# Altium schematic sheet BD4Gv1.SchDoc
size A3
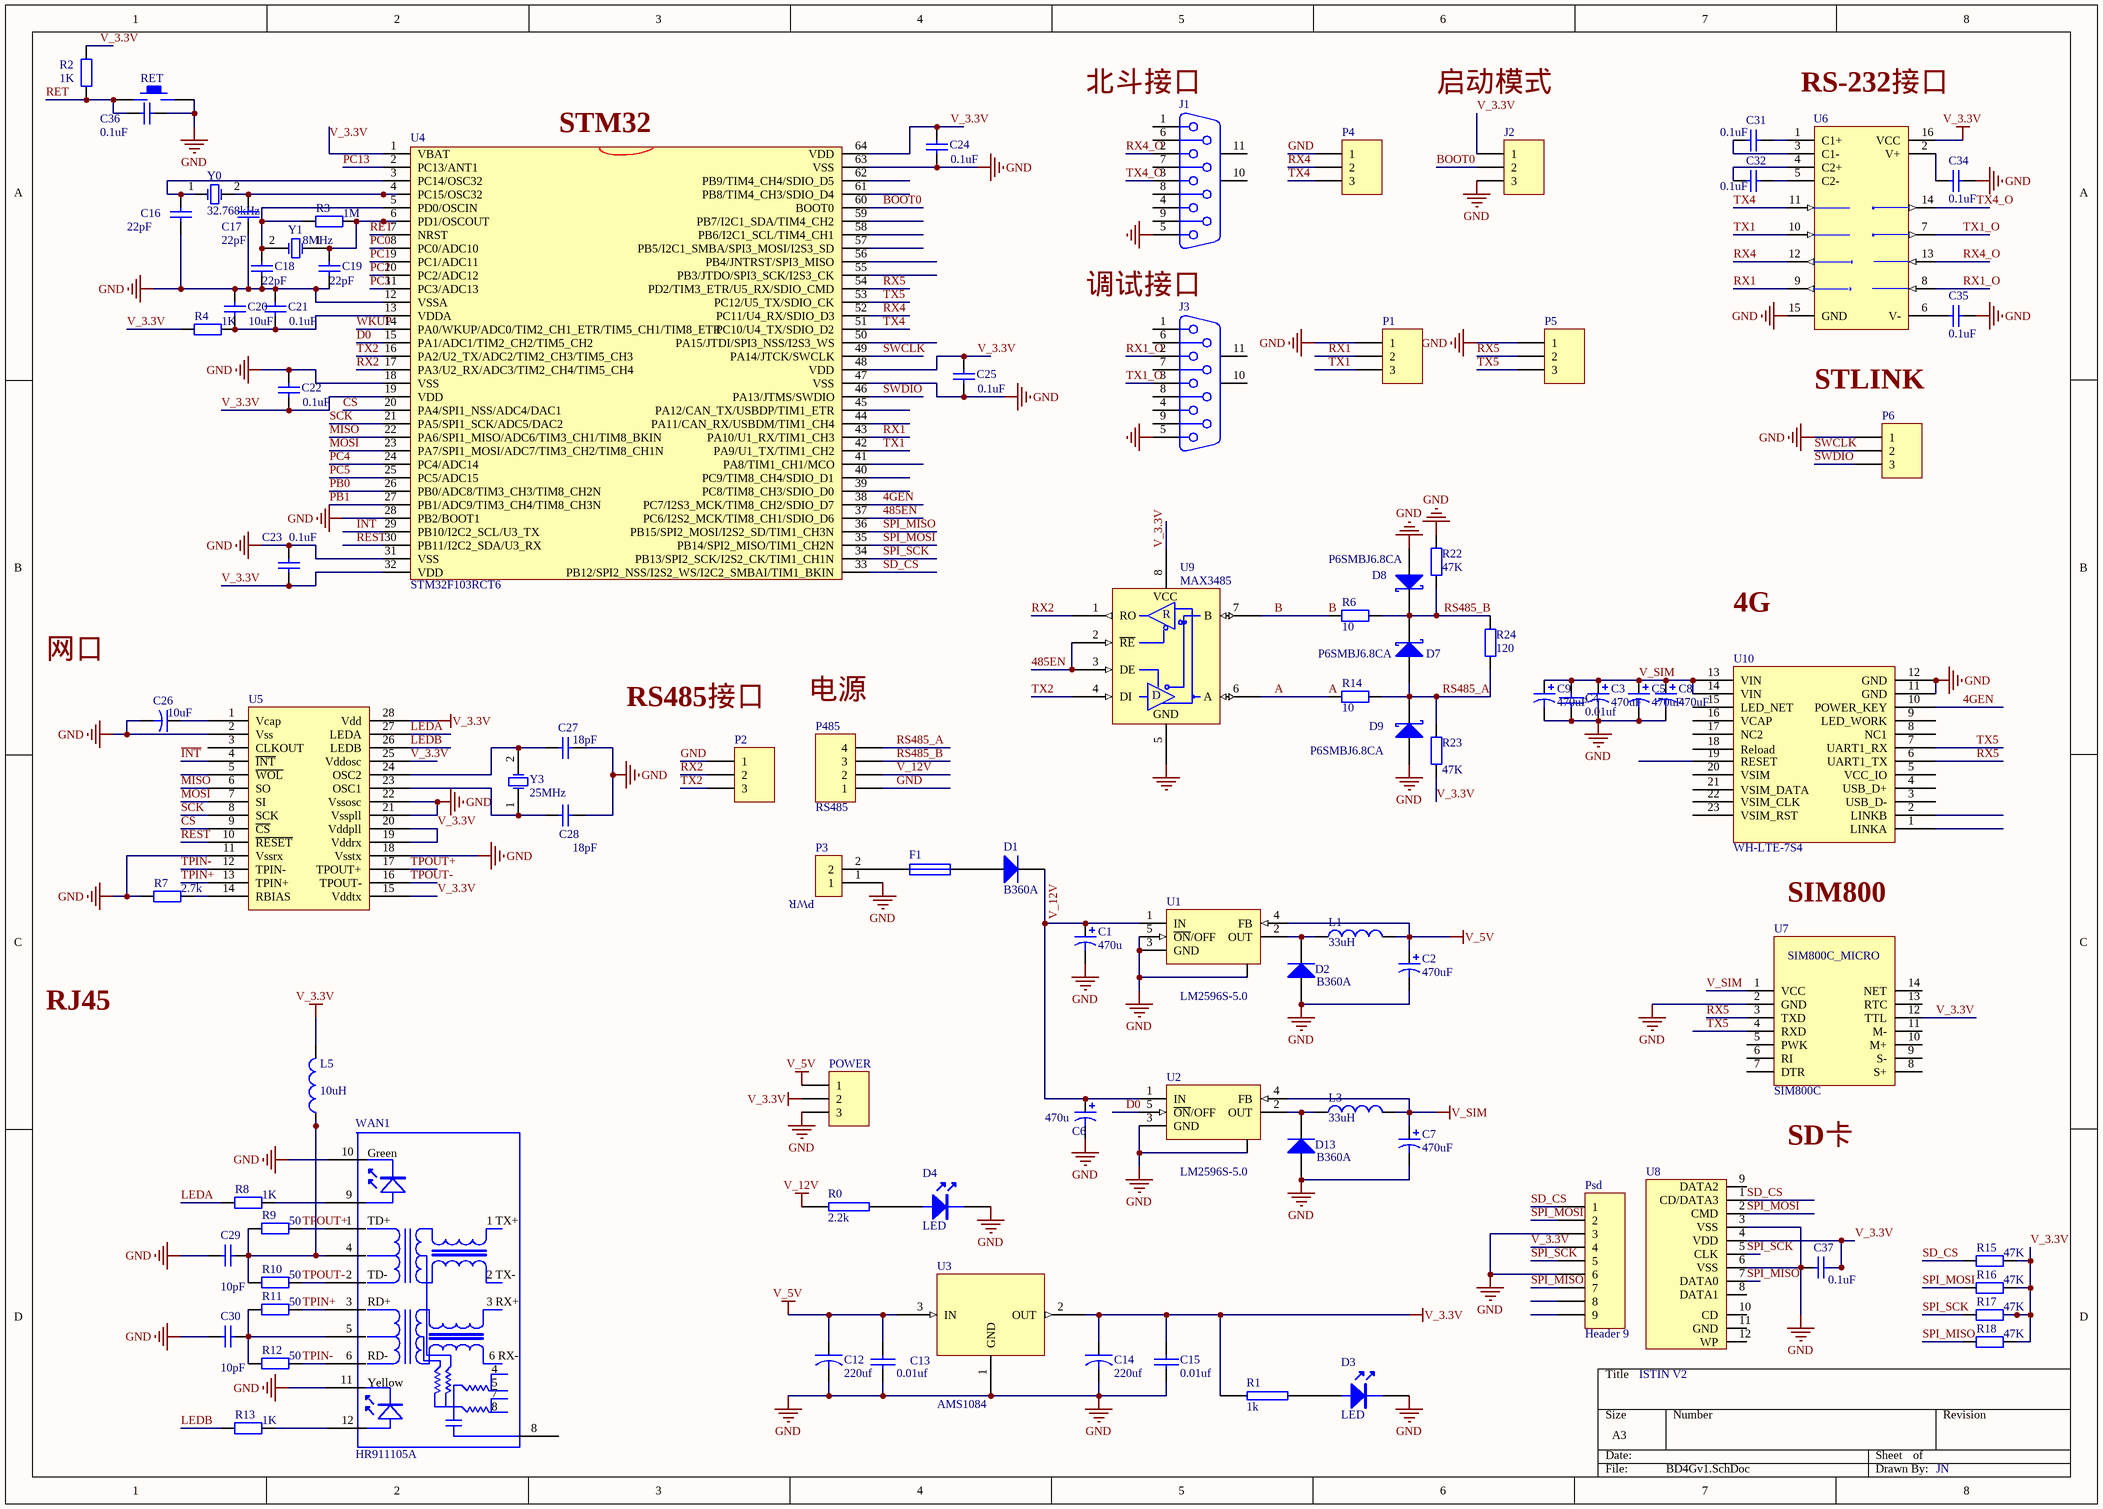
[diagram p0: BD4Gv1.SchDoc]

## Parts
C1  value 470u  [C1007]  (hidden comment: 470u/35V)
C2  value 470uF  [SMC]  (hidden comment: 470u/10V)
C3  value 470uF  [SMC]  (hidden comment: 470u/10V)
C4  0.01uf  [0805]
C5  value 470uF  [SMC]  (hidden comment: 470u/10V)
C6  value 470u  [C1007]  (hidden comment: 470u/35V)
C7  value 470uF  [SMC]  (hidden comment: 470u/10V)
C8  value 470uF  [SMC]  (hidden comment: 470u/10V)
C9  value 470uF  [CC6.56.5]  (hidden comment: 470u/10V)
C12  220uf  [SMC]
C13  0.01uf  [0805]
C14  220uf  [SMC]
C15  0.01uf  [0805]
C16  22pF  [0805]
C17  22pF  [0805]
C18  22pF  [0805]
C19  22pF  [0805]
C20  10uF  [0805]
C21  0.1uF  [0805]
C22  0.1uF  [0805]
C23  0.1uF  [0805]
C24  0.1uF  [0805]
C25  0.1uF  [0805]
C26  10uF  [0805]
C27  18pF  [0805]
C28  18pF  [0805]
C29  10pF  [0805]
C30  10pF  [0805]
C31  0.1uF  [0805]
C32  0.1uF  [0805]
C34  0.1uF  [0805]
C35  0.1uF  [0805]
C36  0.1uF  [0805]
C37  0.1uF  [0805]
D1  B360A  [B360A]
D2  B360A  [B360A]
D3  LED  [LED_side]
D4  LED  [LED_side]
D7  P6SMBJ6.8CA  [DO-2144AA]
D8  P6SMBJ6.8CA  [DO-2144AA]
D9  P6SMBJ6.8CA  [DO-2144AA]
D13  B360A  [B360A]
F1  保险丝  [1812]  (value not drawn)
J1  D Connector 9  [DB9P]  (value not drawn)
J2  boot  [HDR1X3]  (value not drawn)
J3  D Connector 9  [DB9P]  (value not drawn)
L1  33uH  [L0630]
L3  33uH  [L0630]
L5  10uH  [0805]
P1  UART  [HDR1X3]  (value not drawn)
P2  BD-TEST  [HDR1X3]  (value not drawn)
P3  (no value)  [H2_5.08_side]
P4  BD-TEST  [HDR1X3]  (value not drawn)
P5  UART  [HDR1X3]  (value not drawn)
P6  STLINK  [HDR1X3]  (value not drawn)
P485  RS485  [H4_3.81]
POWER  UART  [HDR1X3]  (value not drawn)
Psd  Header 9  [HDR1X9]
R0  2.2k  [0805]
R1  1k  [0805]
R2  1k  [0805]
R3  1M  [0805]
R4  1k  [0805]
R6  10  [0805]
R7  2.7k  [0805]
R8  1k  [0805]
R9  50  [0805]
R10  50  [0805]
R11  50  [0805]
R12  50  [0805]
R13  1k  [0805]
R14  10  [0805]
R15  47k  [0805]
R16  47k  [0805]
R17  47k  [0805]
R18  47k  [0805]
R22  47K  [0805]
R23  47K  [0805]
R24  120  [0805]
RET  KEY_M  [KEY_90]  (value not drawn)
U1  LM2596S-5.0  [936A-02]
U2  LM2596S-5.0  [936A-02]
U3  AMS1084  [TO-252]
U4  STM32F103RCT6  [LQFP64_N]
U5  EN28J60  [SSOP28]  (value not drawn)
U6  MAX3232ESE  [NSO16_N]  (value not drawn)
U7  SIM800C  [PCBComponent_1]
U8  sd card  [MICRO-SD]  (value not drawn)
U9  MAX3485  [NSO8_M]
U10  WH-LTE-7S4  [WH-LTE-7S4]
WAN1  HR911105A  [HR911105A]
Y0  32.768kHz  [XTAL-B]
Y1  8MHz  [贴片晶振]
Y3  25MHz  [4P-Crystal]

## Nets
GND: C1.2 C2.2 C3.2 C4.2 C5.2 C6.2 C7.2 C8.2 C9.2 C12.2 C13.2 C14.2 C15.2 C16.1 C17.1 C18.1 C19.1 C20.2 C21.1 C22.1 C23.1 C24.2 C25.2 C26.1 C27.2 C28.2 C29.1 C30.1 C34.2 C35.2 C36.2 C37.2 D2.1(A) D3.2 D4.2 D8.1(A) D9.1(A) D13.1(A) J1.5 J2.3 J3.5 P1.1 P2.1 P3.1 P4.1 P5.1 P6.1 P485.1 POWER.3 Psd.3 Psd.6 R7.1 R22.1 RET.2 U1.3(GND) U1.5(~{ON}/OFF) U1.6 U2.3(GND) U2.6 U3.1(GND) U4.12(VSSA) U4.18(VSS) U4.28(PB2/BOOT1) U4.31(VSS) U4.47(VSS) U4.63(VSS) U5.2(Vss) U5.11(Vssrx) U5.18(Vsstx) U5.21(Vsspll) U5.22(Vssosc) U6.15(GND) U7.2(GND) U8.3(VSS) U8.6(VSS) U9.5(GND) U10.11(GND) U10.12(GND) WAN1.10 WAN1.11
V_3.3V: C14.1 C15.1 C22.2 C23.2 C24.1 C25.1 C37.1 J2.1 L5.2 POWER.2 Psd.4 R1.2 R2.2 R4.1 R15.2 R16.2 R17.2 R18.2 R23.2 U3.2(OUT) U4.1(VBAT) U4.19(VDD) U4.32(VDD) U4.48(VDD) U4.64(VDD) U5.15(Vddtx) U5.19(Vddrx) U5.20(Vddpll) U5.25(Vddosc) U5.28(Vdd) U6.16(VCC) U7.12(TTL) U8.4(VDD) U9.8(VCC)
V_5V: C2.1 C12.1 C13.1 L1.2 POWER.1 U1.4(FB) U3.3(IN)
V_12V: C1.1 C6.1 D1.2(K) P485.2 R0.2 U1.1(IN) U2.1(IN)
V_SIM: C3.1 C4.1 C5.1 C7.1 C8.1 C9.1 L3.2 U2.4(FB) U7.1(VCC) U10.13(VIN) U10.14(VIN)
4GEN: U4.38(PC7/I2S3_MCK/TIM8_CH2/SDIO_D7) U10.10(POWER_KEY)
485EN: U4.37(PC6/I2S2_MCK/TIM8_CH1/SDIO_D6) U9.2(~{RE}) U9.3(DE)
A: R14.1 U9.6(A)
B: R6.1 U9.7(B)
BOOT0: J2.2 U4.60(BOOT0)
~{CS}: U4.20(PA4/SPI1_NSS/ADC4/DAC1) U5.9(~{CS})
D0: U2.5(~{ON}/OFF) U4.15(PA1/ADC1/TIM2_CH2/TIM5_CH2)
~{INT}: U4.29(PB10/I2C2_SCL/U3_TX) U5.4(~{INT})
LEDA: R8.1 U5.27(LEDA)
LEDB: R13.1 U5.26(LEDB)
MISO: U4.22(PA6/SPI1_MISO/ADC6/TIM3_CH1/TIM8_BKIN) U5.6(SO)
MOSI: U4.23(PA7/SPI1_MOSI/ADC7/TIM3_CH2/TIM8_CH1N) U5.7(SI)
PB0: U4.26(PB0/ADC8/TIM3_CH3/TIM8_CH2N)
PB1: U4.27(PB1/ADC9/TIM3_CH4/TIM8_CH3N)
PC0: U4.8(PC0/ADC10)
PC1: U4.9(PC1/ADC11)
PC2: U4.10(PC2/ADC12)
PC3: U4.11(PC3/ADC13)
PC4: U4.24(PC4/ADC14)
PC5: U4.25(PC5/ADC15)
PC13: U4.2(PC13/ANT1)
REST: U4.30(PB11/I2C2_SDA/U3_RX) U5.10(~{RESET})
RET: C36.1 R2.1 RET.1 U4.7(NRST)
RS485_A: D7.1(A) D9.2(K) P485.4 R14.2 R23.1 R24.2
RS485_B: D7.2(K) D8.2(K) P485.3 R6.2 R22.2 R24.1
RX1: P1.2 U4.43(PA10/U1_RX/TIM1_CH3) U6.9(R2OUT)
RX1_O: J3.2 U6.8(R2IN)
RX2: P2.2 U4.17(PA3/U2_RX/ADC3/TIM2_CH4/TIM5_CH4) U9.1(RO)
RX4: P4.2 U4.52(PC11/U4_RX/SDIO_D3) U6.12(R1OUT)
RX4_O: J1.2 U6.13(R1IN)
RX5: P5.2 U4.54(PD2/TIM3_ETR/U5_RX/SDIO_CMD) U7.3(TXD) U10.6(UART1_TX)
SCK: U4.21(PA5/SPI1_SCK/ADC5/DAC2) U5.8(SCK)
SD_CS: Psd.1 R15.1 U4.33(PB12/SPI2_NSS/I2S2_WS/I2C2_SMBAI/TIM1_BKIN) U8.1(CD/DATA3)
SPI_MISO: Psd.7 R18.1 U4.36(PB15/SPI2_MOSI/I2S2_SD/TIM1_CH3N) U8.7(DATA0)
SPI_MOSI: Psd.2 R16.1 U4.35(PB14/SPI2_MISO/TIM1_CH2N) U8.2(CMD)
SPI_SCK: Psd.5 R17.1 U4.34(PB13/SPI2_SCK/I2S2_CK/TIM1_CH1N) U8.5(CLK)
SWCLK: P6.2 U4.49(PA14/JTCK/SWCLK)
SWDIO: P6.3 U4.46(PA13/JTMS/SWDIO)
TPIN+: R11.2 U5.13(TPIN+) WAN1.3
TPIN-: R12.2 U5.12(TPIN-) WAN1.6
TPOUT+: R9.2 U5.17(TPOUT+) WAN1.1
TPOUT-: R10.2 U5.16(TPOUT-) WAN1.2
TX1: P1.3 U4.42(PA9/U1_TX/TIM1_CH2) U6.10(T2IN)
TX1_O: J3.3 U6.7(T2OUT)
TX2: P2.3 U4.16(PA2/U2_TX/ADC2/TIM2_CH3/TIM5_CH3) U9.4(DI)
TX4: P4.3 U4.51(PC10/U4_TX/SDIO_D2) U6.11(T1IN)
TX4_O: J1.3 U6.14(T1OUT)
TX5: P5.3 U4.53(PC12/U5_TX/SDIO_CK) U7.4(RXD) U10.7(UART1_RX)
WKUP: U4.14(PA0/WKUP/ADC0/TIM2_CH1_ETR/TIM5_CH1/TIM8_ETR)
NetC16_2: C16.2 U4.3(PC14/OSC32) Y0.1(OSC1)
NetC17_2: C17.2 U4.4(PC15/OSC32) Y0.2(OSC2)
NetC18_2: C18.2 R3.1 U4.5(PD0/OSCIN) Y1.2(OSC2)
NetC19_2: C19.2 R3.2 U4.6(PD1/OSCOUT) Y1.1(OSC1)
NetC20_1: C20.1 C21.2 R4.2 U4.13(VDDA)
NetC26_2: C26.2 U5.1(Vcap)
NetC27_1: C27.1 U5.24(OSC2) Y3.2(OSC2)
NetC28_1: C28.1 U5.23(OSC1) Y3.1(OSC1)
NetC29_2: C29.2 L5.1 R9.1 R10.1 WAN1.4
NetC30_2: C30.2 R11.1 R12.1 WAN1.5
NetC31_1: C31.1 U6.3(C1-)
NetC31_2: C31.2 U6.1(C1+)
NetC32_1: C32.1 U6.4(C2+)
NetC32_2: C32.2 U6.5(C2-)
NetC34_1: C34.1 U6.2(V+)
NetC35_1: C35.1 U6.6(V-)
NetD1_1: D1.1(A) F1.2
NetD2_2: D2.2(K) L1.1 U1.2(OUT)
NetD3_1: D3.1 R1.1
NetD4_1: D4.1 R0.1
NetD13_2: D13.2(K) L3.1 U2.2(OUT)
NetF1_1: F1.1 P3.2
NetR7_2: R7.2 U5.14(RBIAS)
NetR8_2: R8.2 WAN1.9
NetR13_2: R13.2 WAN1.12

Not connected (* = marked no-connect by the designer): J1 1 4 6 7 8 9 10(MH1) 11(MH2); J3 1 4 6 7 8 9 10(MH1) 11(MH2); Psd 8 9; U4 39(PC8/TIM8_CH3/SDIO_D0) 40(PC9/TIM8_CH4/SDIO_D1) 41(PA8/TIM1_CH1/MCO) 44(PA11/CAN_RX/USBDM/TIM1_CH4) 45(PA12/CAN_TX/USBDP/TIM1_ETR) 50(PA15/JTDI/SPI3_NSS/I2S3_WS) 55(PB3/JTDO/SPI3_SCK/I2S3_CK) 56(PB4/JNTRST/SPI3_MISO) 57(PB5/I2C1_SMBA/SPI3_MOSI/I2S3_SD) 58(PB6/I2C1_SCL/TIM4_CH1) 59(PB7/I2C1_SDA/TIM4_CH2) 61(PB8/TIM4_CH3/SDIO_D4) 62(PB9/TIM4_CH4/SDIO_D5); U5 3(CLKOUT) 5(~{WOL}); U7 5(PWK) 6(RI) 7(DTR) 8(S+) 9(S-) 10(M+) 11(M-) 13(RTC) 14(NET); U8 8(DATA1) 9(DATA2) 10(CD) 11(GND) 12(WP); U10 1(LINKA) 2(LINKB) 3(USB_D-) 4(USB_D+) 5(VCC_IO) 8(NC1) 9(LED_WORK) 15(LED_NET) 16(VCAP) 17(NC2) 18(Reload) 19(RESET) 20(VSIM) 21(VSIM_DATA) 22(VSIM_CLK) 23(VSIM_RST); WAN1 8

## Notes on the sheet
- (near J1) 北斗接口
- 启动模式
- RS-232接口
- 调试接口
- STLINK
- 4G
- RS485接口
- RJ45
- (near U8) ISTIN V2
- JN
- Labels drawn without touching a wire or pin: SD卡, SIM800, STM32, 电源, 网口
- (in symbol Component_1) SIM800C_MICRO
- (in symbol HR911105A) Green; TD+; 1 TX+; TD-; 2 TX-; RD+; 3 RX+; RD-; 6 RX-; Yellow; 7
- (in symbol MAX1487E) R; D

## Library data of the parts
C1-C3 C5-C9 = Cap Pol3: Polarized Capacitor (Surface Mount); Published: 8-Jun-2000; LatestRevisionDate: 29-May-2009; LatestRevisionNote: IPC-7351 Footprint Added.; PackageReference: C0805; Publisher: Altium Limited; PackageDescription: Chip Capacitor
C4 C13 C15 = CAP: Capacitor
C12 C14 = CAPACITOR
C16-C25 C27-C32 C34-C37 = Cap: Capacitor; Published: 8-Jun-2000; LatestRevisionDate: 17-Jul-2002; LatestRevisionNote: Re-released for DXP Platform.; PackageReference: RAD-0.3; Publisher: Altium Limited
  C16-C19: PackageDescription: Radial Cap, Thru-Hole; 2 Leads; 0.3 in Pin Spacing; Value: 22pF
  C20: PackageDescription: Radial Cap, Thru-Hole; 2 Leads; 0.3 in Pin Spacing; Value: 10uF
  C21-C25 C36 C37: PackageDescription: Radial Cap, Thru-Hole; 2 Leads; 0.3 in Pin Spacing; Value: 0.1uF
  C27 C28: PackageDescription: Radial Cap, Thru-Hole; 2 Leads; 0.3 in Pin Spacing; Value: 18pF
  C29 C30: PackageDescription: Radial Cap, Thru-Hole; 2 Leads; 0.3 in Pin Spacing; Value: 10pF
  C31 C32 C34 C35: Value: 0.1uF
C26 = Cap2: Capacitor; Published: 23-Sep-2002; PackageReference: CAPR5-4X5; Publisher: Altium Limited; PackageDescription: Capacitor; 2 Leads; Value: 10uF
D1 D2 D13 = Diode: Default Diode; Published: 8-Jun-2000; LatestRevisionDate: 17-Jul-2002; LatestRevisionNote: Re-released for DXP Platform.; PackageVersion: Sep-1996; PackageReference: SMA; Publisher: Altium Limited; Code_JEDEC: DO-214-AB
D7-D9 = D Schottky: Schottky Diode; Published: 8-Jun-2000; LatestRevisionDate: 17-Jul-2002; LatestRevisionNote: Re-released for DXP Platform.; PackageReference: SMB; Publisher: Altium Limited; PackageDescription: DO-214-AA/SMB; 2 C-Bend Leads; Body 5.3 x 3.6 mm, inc. leads (LxW); Code_JEDEC: DO-214-AA
F1 = Fuse 1: Fuse; Published: 8-Jun-2000; LatestRevisionDate: 17-Jul-2002; LatestRevisionNote: Re-released for DXP Platform.; PackageReference: PIN-W2/E2.8; Publisher: Altium Limited; PackageDescription: Thru-Hole; 2 Leads
J1 J3 = D Connector 9: Receptacle Assembly, 9 Position, Right Angle; PackageDocument: O; Positions: 9; Published: 15-Jun-2001; LatestRevisionDate: 17-Jul-2002; LatestRevisionNote: Re-released for DXP Platform.; DatasheetDocument: 1-Sep-1999; PackageReference: 788750; Publisher: Altium Limited; Orientation: Right Angle; Gender: Receptacle
J2 P1 P5 P6 POWER = Header 3: Header, 3-Pin; LatestRevisionDate: 17-Jul-2002; LatestRevisionNote: Re-released for DXP Platform.; Publisher: Altium Limited
L1 L3 = Inductor: Inductor,3A; Code_IEC: 1005; Published: 8-Jun-2000; LatestRevisionDate: 29-May-2009; LatestRevisionNote: IPC-7351 Footprint Added.; PackageReference: 0402-A; Publisher: Altium Limited; PackageDescription: Chip Inductor; Code_JEITA: 0402; Value: 33uH
L5 = Inductor: Code_IEC: 1005; Published: 8-Jun-2000; LatestRevisionDate: 29-May-2009; LatestRevisionNote: IPC-7351 Footprint Added.; PackageReference: 0402-A; Publisher: Altium Limited; PackageDescription: Chip Inductor; Code_JEITA: 0402; Value: 10uH
P2 P4 = MHDR1X3: Header, 3-Pin; LatestRevisionDate: 17-Jul-2002; LatestRevisionNote: Re-released for DXP Platform.; Publisher: Altium Limited
P3 = PWR
P485 = Header 4: Header, 4-Pin; LatestRevisionDate: 17-Jul-2002; LatestRevisionNote: Re-released for DXP Platform.; Publisher: Altium Limited
Psd = Header 9: Header, 9-Pin; LatestRevisionDate: 17-Jul-2002; LatestRevisionNote: Re-released for DXP Platform.; Publisher: Altium Limited
R0 R1 = RES2
R2-R4 R6-R18 R22-R24 = Res2: Resistor; Published: 8-Jun-2000; LatestRevisionDate: 17-Jul-2002; LatestRevisionNote: Re-released for DXP Platform.; PackageReference: AXIAL-0.4; Publisher: Altium Limited; PackageDescription: Axial Device, Thru-Hole; 2 Leads; 0.4 in Pin Spacing
  R2 R4 R8 R13: Value: 1K
  R3: Value: 1M
  R6 R14: Value: 10
  R7: Value: 2.7k
  R9-R12: Value: 50
  R15-R18 R22 R23: Value: 47K
U1 U2 = LM2596S-5.0: 5V稳压芯片; Note: Tab is connected to GND; Published: 15-Apr-2002; DatasheetVersion: Dec-1997; PackageReference: TS5B; Publisher: Altium Limited; PackageDescription: D2-PAK; 5 Leads; Body 14.4 (inc. leads) x 10.4 mm (LxW max); ComponentLink1Description: Manufacturer Link; ComponentLink1URL: http://www.national.com/; ComponentLink2Description: Datasheet; ComponentLink2URL: http://www.national.com/ds.cgi/LM/LM2596.pdf; ComponentLink3Description: URL Link1; ComponentLink3URL: http://www.national.com/pf/LM/LM2596.html
U3 = AMS117
U4 = STM32F103RDT6
U6 = MAX3232ESE: 3.0V TO 5.5V, Low-Power, up to 1Mbps, True RS-232 Transceiver Using Four 0.1µF External Capacitor; Published: 16-Jan-2001; LatestRevisionDate: 13-Apr-2006; LatestRevisionNote: IPC-7351 Footprint Added.; DatasheetVersion: Mar-1999; PackageReference: NSO16; Publisher: Altium Limited; PackageDescription: 16-Pin Small Outline Integrated Circuit 1.27 mm Pitch; Code_JEDEC: MS-012-AC; Code_IPC: SOIC127P600-16; ComponentLink1Description: Manufacturer Link; ComponentLink1URL: http://www.maxim-ic.com/; ComponentLink2Description: Datasheet; ComponentLink2URL: http://pdfserv.maxim-ic.com/en/ds/MAX3222-MAX3241.pdf
U7 = Component_1
U9 = MAX1487E: Part Field 1: 1; Part Field 2: 0; Part Field 3: 0; Part Field 4: 0; Part Field 5: 1; Part Field 6: 1K
Y0 Y1 = XTAL: Crystal Oscillator; Published: 8-Jun-2000; LatestRevisionDate: 17-Jul-2002; LatestRevisionNote: Re-released for DXP Platform.; Publisher: Altium Limited
Y3 = XTAL: Crystal Oscillator; pin to pad: 2>3; Published: 8-Jun-2000; LatestRevisionDate: 17-Jul-2002; LatestRevisionNote: Re-released for DXP Platform.; PackageReference: R38; Publisher: Altium Limited; PackageDescription: Crystal, Thru-Hole; 2 Leads; Body 3.1 x 8.2 mm (Dia.xH)